# EAGLE schematic ArduBerry 3_0 (EAGLE 6.3)
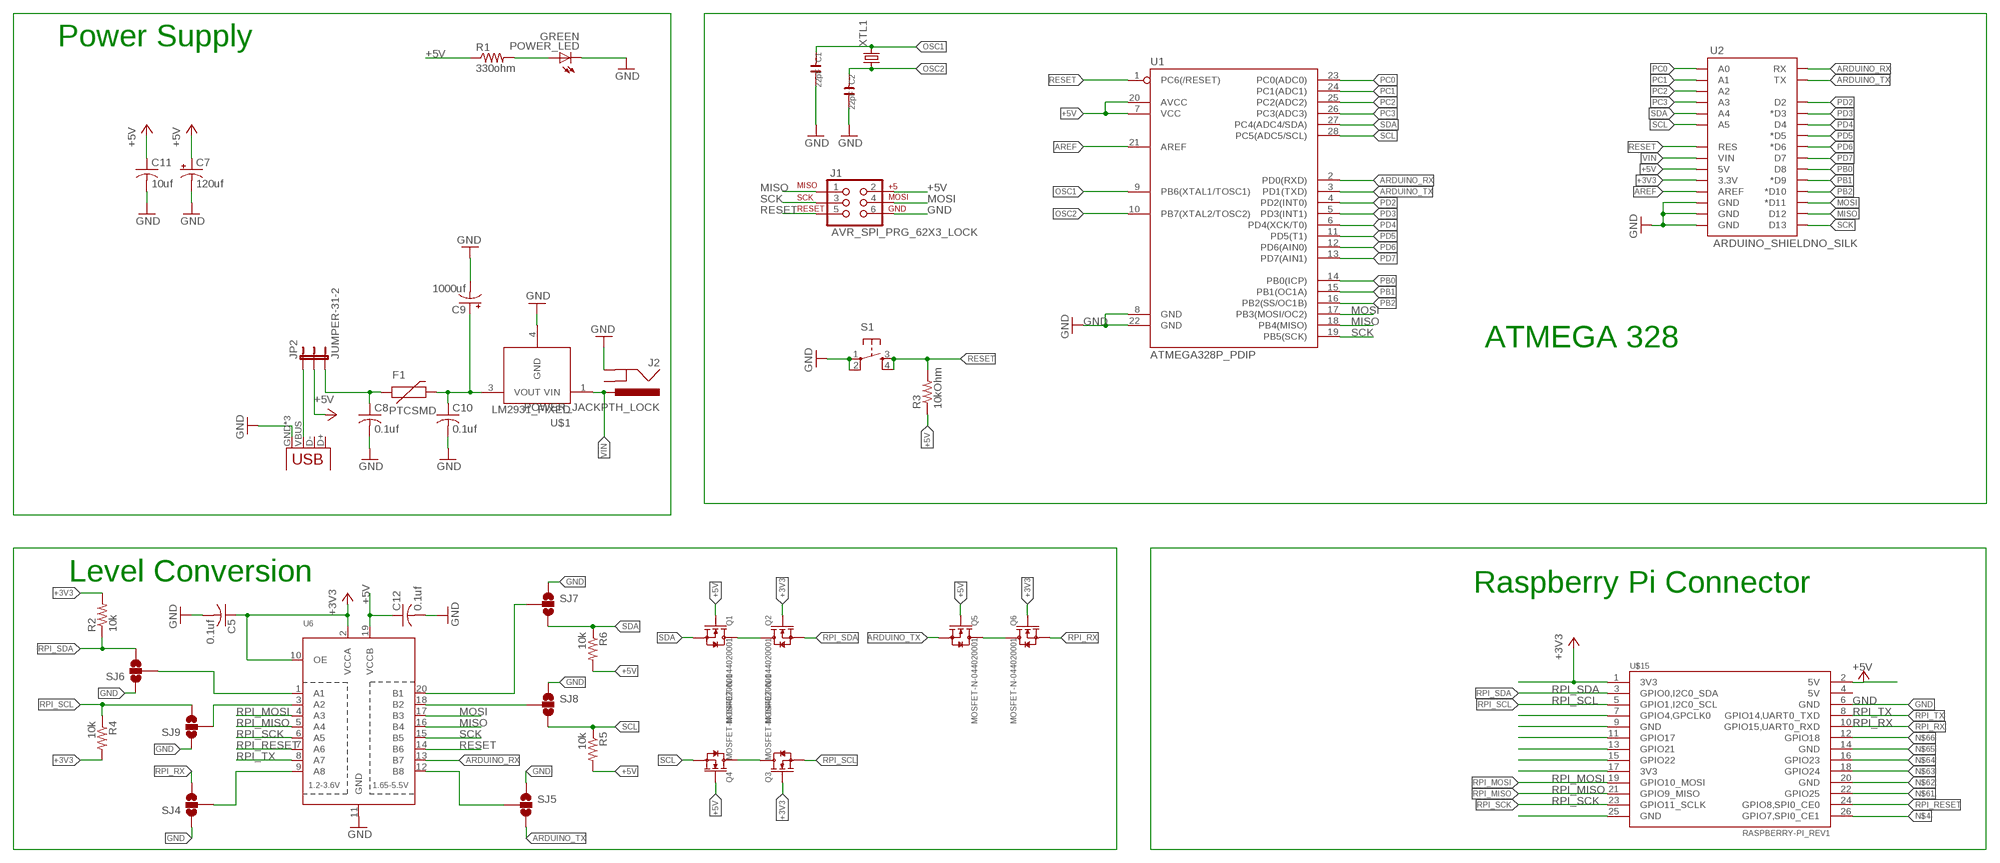
[diagram p0: schematic, sheet 1]

## Parts
C1  22pF  C-0805  [C0805]
C2  22pF  C-0805  [C0805]
C5  0.1uf  C-USC0603  [C0603]
C7  120uf  CPOL-USE2.5-6  [E2,5-6]
C8  0.1uf  C-USC0603  [C0603]
C9  1000uf  CPOL-USE3.5-10  [E3,5-10]
C10  0.1uf  C-USC0603  [C0603]
C11  10uf  C-USC0805  [C0805]
C12  0.1uf  C-USC0603  [C0603]
F1  PTCSMD  [PTC-1206]
J1  AVR_SPI_PRG_62X3_LOCK  [2X3_LOCK]
J2  POWER_JACKPTH_LOCK  [POWER_JACK_PTH_LOCK]
JP1  USB-MICROB  [USB-MICROB]
JP2  JUMPER-31-2  [SJ_3_PASTE1&2]
POWER_LED  GREEN  LED-GREEN0603  [LED-0603]
Q1  MOSFET-N-044020001  [SOT23]
Q2  MOSFET-N-044020001  [SOT23]
Q3  MOSFET-N-044020001  [SOT23]
Q4  MOSFET-N-044020001  [SOT23]
Q5  MOSFET-N-044020001  [SOT23]
Q6  MOSFET-N-044020001  [SOT23]
R1  330ohm  RESISTOR0603  [0603-RES]
R2  10k  RESISTOR0603  [0603-RES]
R3  10kOhm  RESISTOR0603  [0603-RES]
R4  10k  RESISTOR0603  [0603-RES]
R5  10k  RESISTOR0603  [0603-RES]
R6  10k  RESISTOR0603  [0603-RES]
S1  TAC_SWITCHSMD  [TACTILE_SWITCH_SMD]
SJ4  SOLDERJUMPER_2WAYPASTE1&2  [SJ_3_PASTE1&2]
SJ5  SOLDERJUMPER_2WAYPASTE1&2  [SJ_3_PASTE1&2]
SJ6  SOLDERJUMPER_2WAYPASTE1&2  [SJ_3_PASTE1&2]
SJ7  SOLDERJUMPER_2WAYPASTE1&2  [SJ_3_PASTE1&2]
SJ8  SOLDERJUMPER_2WAYPASTE1&2  [SJ_3_PASTE1&2]
SJ9  SOLDERJUMPER_2WAYPASTE1&2  [SJ_3_PASTE1&2]
U1  ATMEGA328P_PDIP  [DIL28-3]
U2  ARDUINO_SHIELDNO_SILK  [DUEMILANOVE_VIAS]
U6  TXB0108PWR  [TSSOP20]
U$1  LM2931_FIXED  [DPAK]
U$15  RASPBERRY-PI_REV1  [RASPBERRY-PI_REV1]
XTL1  CRYSTALHC49S  [HC49/S]

## Nets
5V_IN_USB: JP1.VBUS JP2.1
+3V3 [POWER]: C5.1 Q2.1(G) Q3.1(G) Q6.1(G) R2.2 R4.2 U2.3.3V U6.2(VCCA) U6.10(OE) U$15.1(3V3)
+5V [POWER]: C7.+ C11.1 C12.1 J1.2 JP2.2 Q1.1(G) Q4.1(G) Q5.1(G) R1.1 R3.1 R5.2 R6.2 U1.7(VCC) U1.20(AVCC) U2.5V U6.19(VCCB) U$15.2(5V)
ARDUINO_RX: U1.2(PD0(RXD)) U2.RX U6.13(B7)
ARDUINO_TX: Q5.2(S) SJ5.3 U1.3(PD1(TXD)) U2.TX
AREF [DATA]: U1.21(AREF) U2.AREF
GND: C1.2 C2.2 C5.2 C7.- C8.2 C9.- C10.2 C11.2 C12.2 J1.6 J2.GND JP1.GND JP1.MT1(GND) JP1.MT2(GND) POWER_LED.C S1.1 S1.2 SJ4.1 SJ5.1 SJ6.1 SJ7.1 SJ8.1 SJ9.1 U1.8(GND) U1.22(GND) U2.GND@0(GND) U2.GND@1(GND) U2.GND@2(GND) U6.11(GND) U$1.4(GND) U$15.6(GND)
MISO: J1.1 U1.18(PB4(MISO)) U2.D12 U6.16(B4)
MOSI: J1.4 U1.17(PB3(MOSI/OC2)) U2.D11(*D11) U6.17(B3)
N$1: Q1.3(D) Q2.3(D)
N$2: Q3.3(D) Q4.3(D)
N$3: Q5.3(D) Q6.3(D)
N$4: U$15.26(GPIO7,SPI0_CE1)
N$7: SJ6.2 U6.1(A1)
N$8: SJ9.2 U6.3(A2)
N$9: SJ4.2 U6.9(A8)
N$11: POWER_LED.A R1.2
N$13: SJ5.2 U6.12(B8)
N$14: SJ8.2 U6.18(B2)
N$15: SJ7.2 U6.20(B1)
N$48: U$15.7(GPIO4,GPCLK0)
N$49: U$15.9(GND)
N$50: U$15.11(GPIO17)
N$51: U$15.13(GPIO21)
N$52: U$15.15(GPIO22)
N$53: U$15.17(3V3)
N$54: U$15.25(GND)
N$61: U$15.22(GPIO25)
N$62: U$15.20(GND)
N$63: U$15.18(GPIO24)
N$64: U$15.16(GPIO23)
N$65: U$15.14(GND)
N$66: U$15.12(GPIO18)
OSC1: C1.1 U1.9(PB6(XTAL1/TOSC1)) XTL1.2
OSC2: C2.1 U1.10(PB7(XTAL2/TOSC2)) XTL1.1
PB0: U1.14(PB0(ICP)) U2.D8
PB1: U1.15(PB1(OC1A)) U2.D9(*D9)
PB2: U1.16(PB2(SS/OC1B)) U2.D10(*D10)
PC0: U1.23(PC0(ADC0)) U2.A0
PC1: U1.24(PC1(ADC1)) U2.A1
PC2: U1.25(PC2(ADC2)) U2.A2
PC3: U1.26(PC3(ADC3)) U2.A3
PD2: U1.4(PD2(INT0)) U2.D2
PD3: U1.5(PD3(INT1)) U2.D3(*D3)
PD4: U1.6(PD4(XCK/T0)) U2.D4
PD5: U1.11(PD5(T1)) U2.D5(*D5)
PD6: U1.12(PD6(AIN0)) U2.D6(*D6)
PD7: U1.13(PD7(AIN1)) U2.D7
REG_OUT [POWER]: C8.1 F1.1 JP2.3
RESET: J1.5 R3.2 S1.3 S1.4 U1.1(PC6(/RESET)) U2.RES U6.14(B6)
RPI_MISO: U6.5(A4) U$15.21(GPIO9_MISO)
RPI_MOSI: U6.4(A3) U$15.19(GPIO10_MOSI)
RPI_RESET: U6.7(A6) U$15.24(GPIO8,SPI0_CE0)
RPI_RX: Q6.2(S) SJ4.3 U$15.10(GPIO15,UART0_RXD)
RPI_SCK: U6.6(A5) U$15.23(GPIO11_SCLK)
RPI_SCL: Q3.2(S) R4.1 SJ9.3 U$15.5(GPIO1,I2C0_SCL)
RPI_SDA: Q2.2(S) R2.1 SJ6.3 U$15.3(GPIO0,I2C0_SDA)
RPI_TX: U6.8(A7) U$15.8(GPIO14,UART0_TXD)
SCK: J1.3 U1.19(PB5(SCK)) U2.D13 U6.15(B5)
SCL: Q4.2(S) R5.1 SJ8.3 U1.28(PC5(ADC5/SCL)) U2.A5
SDA: Q1.2(S) R6.1 SJ7.3 U1.27(PC4(ADC4/SDA)) U2.A4
VIN: J2.PWR U2.VIN U$1.1(VIN)
VIN_5V: C9.+ C10.1 F1.2 U$1.3(VOUT)
Unconnected: J2.GNDBREAK JP1.D+ JP1.D- U$15.4(5V)

## Notes on the sheet
- Power Supply
- ATMEGA 328
- Level Conversion
- Raspberry Pi Connector

## Library data of the parts
C1 C2 = OPL:C*
C5 C8 C10 C12 = resistor:C-US: CAPACITOR, American symbol
C7 C9 = rcl:CPOL-US: POLARIZED CAPACITOR, American symbol
C11 = rcl:C-US: CAPACITOR, American symbol
F1 = zz SparkFun:PTC: Resettable Fuse PTC Resettable Fuse. Spark Fun Electronics SKU : COM-08357
J1 = SparkFun-Connectors:AVR_SPI_PRG_6: AVR ISP 6 Pin This is the reduced ISP connector for AVR programming. Common on Arduino. This footprint will take up less PCB space and can be used with a 10-pin to 6-pin adapter such as SKU: BOB-08508
J2 = SparkFun-Connectors:POWER_JACK: Power Jack This is the standard 5.5mm barrel jack for power. The PTH is the most common, proven, reliable, footprint. The Slot footprint only works if the mill layer is transmitted to the PCB fab house so be warned. Spark Fun Electronics SKU : PRT-00119 SMT: CONN-08106 Mating wall wart : TOL-00298 (and others)
JP1 = SparkFun-Connectors:USB: USB Connectors USB-B-PTH is fully proven SKU : PRT-00139/CONN-08278 USB-miniB is fully proven SKU : PRT-00587 USB-A-PCB is untested. USB-A-H is throughly reviewed, but untested. Spark Fun Electronics SKU : PRT-00437 USB-B-SMT is throughly reviewed, but untested. Needs silkscreen touching up. USB-A-S has not been used/tested USB-MB-H has not been used/tested USB-MICROB has been used. CONN-09505; PROD_ID: CONN-09505
JP2 = SparkFun-Passives:JUMPER-3
POWER_LED = SparkFun-LED:LED-GREEN: Various green LEDs 0603- DIO-00821 LARGE- DIO-00862 LILYPAD- DIO-09910; PROD_ID: DIO-00821
Q1-Q6 = OPL:MOSFET-N: CJ2302：SMD MOSFET N-CH 20V-2.1A
R1-R6 = SparkFun-Resistors:RESISTOR: Resistor Basic schematic elements and footprints for 0603, 1206, and PTH resistors.
S1 = SparkFun-Electromechanical:TAC_SWITCH: Momentary Switch Button commonly used for reset or general input. Spark Fun Electronics SKU : COM-00097 SMT- SWCH-08247; PROD_ID: SWCH-08247
SJ4-SJ9 = SparkFun-Passives:SOLDERJUMPER_2WAY: Solder Jumper 2 way solder jumper
U1 = SparkFun-DigitalIC:ATMEGA328P_PDIP: uC used in the Arduino 32kb flash, 1k EEPROM, 2k SRAM This is the through-hole version of this chip.
U2 = SparkFun-Boards:ARDUINO_SHIELD: Arduino shield footprint
U6 = adafruit:TXB0108PWR: 8-Bit Bi-Directional Level Shifter 1.2V-3.6V (VCCA) to 1.65V-5.5V (VCCB) bi-directional level shifter with auto direction sensing. Max data rate - VCCA 1.8V: 20Mbps (50ns), VCCA 3.3V: 100Mbps (10ns) Digikey: 296-21527-1-ND
U$1 = SparkFun-PowerIC:LM2931_FIXED: LDO regulator with reverse battery protection- very durable!
U$15 = RaspberryPi:RASPBERRY-PI_REV1: Raspberry Pi Board <http://www.raspberrypi.org/> Jacques Lagnel V1.0 (beta) 2012 Mateusz Bawaj V1.1 (beta) 2012 Board dimension: Forum 3D model <http://www.raspberrypi.org/forum/general-discussion/mechanical-profile-3d-models?value=3d%20model&type=1&include=1&search=1&ret=all> The GPIO Connector (P1): http://elinux.org/RPi_Low-level_peripherals
XTL1 = crystal:CRYSTAL: CRYSTAL; OC_FARNELL: 1667008; OC_NEWARK: unknown

## Net classes
1 DATA: width 0.203 mm, drill 0.305 mm, clearance 0.051 mm
2 POWER: width 0.406 mm, drill 0.356 mm, clearance 0.051 mm